# EAGLE schematic Main (EAGLE 9.5.2)
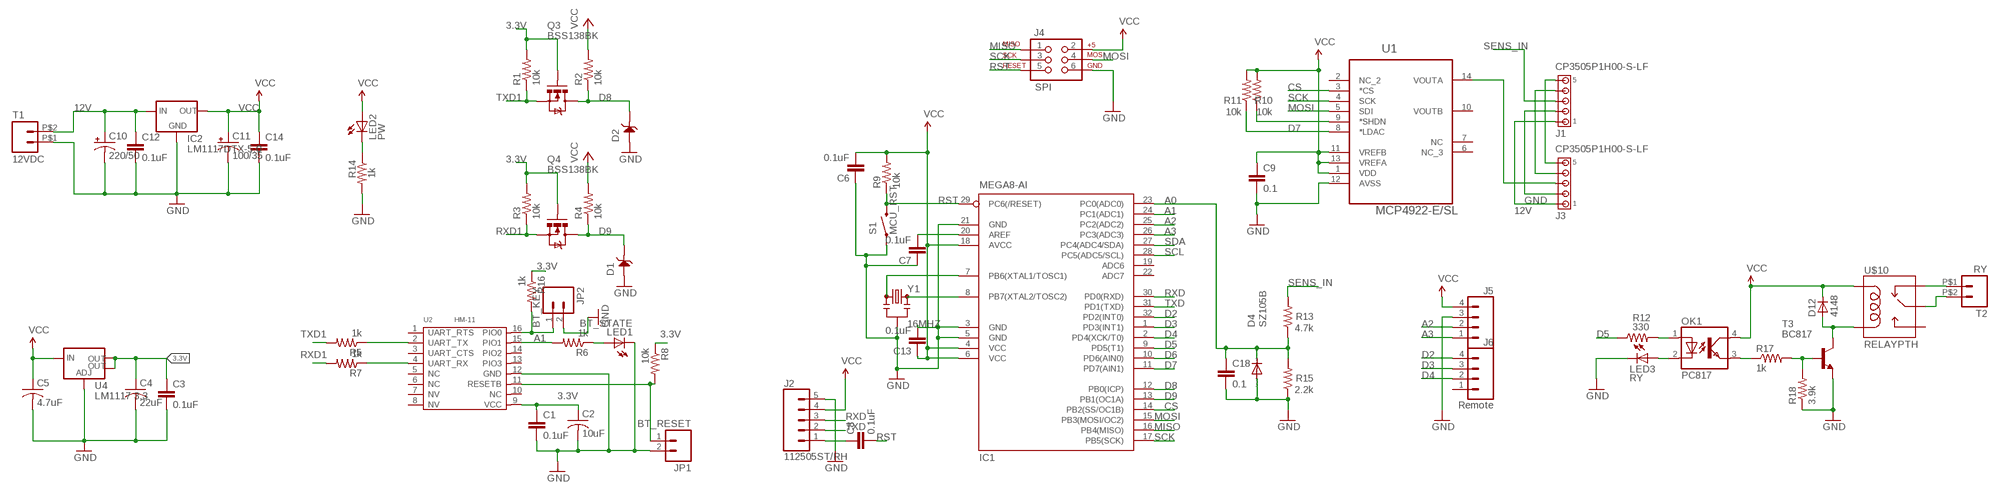
[diagram p0: schematic, sheet 1]

## Parts
C1  0.1uF  CAP0805  [0805]
C2  10uF  C-USC1206  [C1206]
C3  0.1uF  CAP0805  [0805]
C4  22uF  C-USC1206  [C1206]
C5  4.7uF  C-USC1206  [C1206]
C6  0.1uF  CAP0805  [0805]
C7  0.1uF  CAP0805  [0805]
C8  0.1uF  CAP0805  [0805]
C9  0.1  CAP0805  [0805]
C10  220/50  CPOL-US153CLV-1010  [153CLV-1010]
C11  100/35  CPOL-US153CLV-0605  [153CLV-0605]
C12  0.1uF  CAP0805  [0805]
C13  0.1uF  CAP0805  [0805]
C14  0.1uF  CAP0805  [0805]
C18  0.1  CAP0805  [0805]
D1  SMF5.0A  D-ESD-2P'CESD5V0D1'  [SOD123-2.7X1.6]
D2  SMF5.0A  D-ESD-2P'CESD5V0D1'  [SOD123-2.7X1.6]
D4  SZ105B  DIODE-DO-214AC  [DO-214AC]
D12  4148  D-SOD-80  [SOD80]
IC1  MEGA8-AI  [TQFP32-08]
IC2  LM1117DTX-5.0  LM1117DTX-3.3  [TO252]
J1  CP3505P1H00-S-LF  1445055-5  [1445055-5]
J2  112505ST/RH  CONN_05JST  [JST-5-PTH]
J3  CP3505P1H00-S-LF  1445055-5  [1445055-5]
J4  SPI  AVR_SPI_PRG_6PTH  [2X3]
J5  CONN_04JST-PTH  [JST-4-PTH]
J6  Remote  CONN_04JST-PTH  [JST-4-PTH]
JP1  BT_RESET  M02PTH  [1X02]
JP2  BT_KEY  M02PTH  [1X02]
LED1  BT_STATE  LED3MM  [LED3MM]
LED2  PW  LED3MM  [LED3MM]
LED3  RY  LED3MM  [LED3MM]
OK1  PC817  LTV816S  [DIL4-SMD]
Q3  BSS138BK  MOSFET-NCHANNELBSS138  [SOT23-3]
Q4  BSS138BK  MOSFET-NCHANNELBSS138  [SOT23-3]
R1  10k  RESISTOR0805-RES  [0805]
R2  10k  RESISTOR0805-RES  [0805]
R3  10k  RESISTOR0805-RES  [0805]
R4  10k  RESISTOR0805-RES  [0805]
R5  1k  RESISTOR0805-RES  [0805]
R6  1k  RESISTOR0805-RES  [0805]
R7  1k  RESISTOR0805-RES  [0805]
R8  10k  RESISTOR0805-RES  [0805]
R9  10k  RESISTOR0805-RES  [0805]
R10  10k  RESISTOR0805-RES  [0805]
R11  10k  RESISTOR0805-RES  [0805]
R12  330  RESISTOR0805-RES  [0805]
R13  4.7k  RESISTOR0805-RES  [0805]
R14  1k  RESISTOR0805-RES  [0805]
R15  2.2k  RESISTOR0805-RES  [0805]
R16  1k  RESISTOR0805-RES  [0805]
R17  1k  RESISTOR0805-RES  [0805]
R18  3.9k  RESISTOR0805-RES  [0805]
S1  MCU_RST  SWITCH-MOMENTARY-2SMD-1101NE  [TACTILE-SWITCH-1101NE]
T1  12VDC  ST02-3.5MM  [ED350V-02P]
T2  RY  ST02-3.5MM  [ED350V-02P]
T3  BC817  BC817-16-NPN-SOT23-BEC  [SOT23-BEC]
U1  MCP4922-E/SL  [SOIC127P600X175-14N]
U2  HM-11  [16P-18.5X13.5X0.8]
U4  LM1117 3.3  V_REG_LM1117SOT223  [SOT223]
U$10  RELAYPTH  [SRD-05VDC-SL-C]
Y1  16MHZ  RESONATOR16MHZ  [RESONATOR-SMD]

## Nets
3.3V: C1.1 C2.1 C3.1 C4.1 Q3.1(G) Q4.1(G) R1.2 R3.2 R8.1 R16.1 U2.9(VCC) U4.2(OUT) U4.4(OUT)
12V: C10.+ C12.1 IC2.2(IN) J1.1 J3.1 T1.P$2
A0: C18.1 D4.C IC1.23(PC0(ADC0)) R13.1 R15.2
A1: IC1.24(PC1(ADC1)) R6.2 U2.15(PIO1)
A2: IC1.25(PC2(ADC2)) J5.2
A3: IC1.26(PC3(ADC3)) J5.1
CS: IC1.14(PB2(SS/OC1B)) U1.3(*CS)
D2: IC1.32(PD2(INT0)) J6.4
D3: IC1.1(PD3(INT1)) J6.3
D4: IC1.2(PD4(XCK/T0)) J6.2
D5: IC1.9(PD5(T1)) R12.1
D6: IC1.10(PD6(AIN0))
D7: IC1.11(PD7(AIN1)) R11.1 U1.8(*LDAC)
D8: D2.2 IC1.12(PB0(ICP)) Q3.3(D) R2.1
D9: D1.2 IC1.13(PB1(OC1A)) Q4.3(D) R4.1
GND: C1.2 C2.2 C3.2 C4.2 C5.2 C6.1 C7.1 C9.2 C10.- C11.- C12.2 C13.2 C14.2 C18.2 D1.1 D2.1 D4.A IC1.3(GND) IC1.5(GND) IC1.21(GND) IC2.1(GND) J1.2 J2.5 J3.2 J4.6 J5.3 JP1.2 JP2.2 LED1.K(C) LED3.K(C) R14.2 R15.1 R18.1 S1.1 T1.P$1 T3.E U1.12(AVSS) U2.12(GND) U4.1(ADJ) Y1.2
MISO: IC1.16(PB4(MISO)) J4.1
MOSI: IC1.15(PB3(MOSI/OC2)) J4.4 U1.5(SDI)
N$1: LED1.A R6.1
N$2: JP2.1 R16.2 U2.16(PIO0)
N$3: R5.1 U2.2(UART_TX)
N$4: JP1.1 R8.2 U2.11(RESETB)
N$5: IC1.8(PB7(XTAL2/TOSC2)) Y1.3
N$6: R7.1 U2.4(UART_RX)
N$7: IC1.7(PB6(XTAL1/TOSC1)) Y1.1
N$8: C7.2 IC1.20(AREF)
N$9: C8.1 J2.1
N$12: LED2.K(C) R14.1
N$13: J3.3 U1.14(VOUTA)
N$14: J1.5 J3.5
N$15: J1.4 J3.4
N$16: R10.1 U1.9(*SHDN)
N$20: OK1.3(EMIT) R17.1
N$21: R17.2 R18.2 T3.B
N$22: D12.2(A) T3.C U$10.COIL0
N$23: OK1.1(A) R12.2
N$24: T2.P$1 U$10.SWCLOSED(SWCLOSE)
N$25: T2.P$2 U$10.SWCOMMON
N$31: LED3.A OK1.2(C)
RST: C8.2 IC1.29(PC6(/RESET)) J4.5 R9.1 S1.2
RXD: IC1.30(PD0(RXD)) J2.3
RXD1: Q4.2(S) R3.1 R7.2
SCK: IC1.17(PB5(SCK)) J4.3 U1.4(SCK)
SCL: IC1.28(PC5(ADC5/SCL))
SDA: IC1.27(PC4(ADC4/SDA))
SENS_IN: J1.3 R13.2
TXD: IC1.31(PD1(TXD)) J2.2
TXD1: Q3.2(S) R1.1 R5.2
VCC: C5.1 C6.2 C9.1 C11.+ C13.1 C14.1 D12.1(C) IC1.4(VCC) IC1.6(VCC) IC1.18(AVCC) IC2.TAB(OUT) J2.4 J4.2 J5.4 LED2.A OK1.4(COL) R2.2 R4.2 R9.2 R10.2 R11.2 U1.1(VDD) U1.11(VREFB) U1.13(VREFA) U4.3(IN) U$10.COIL1
Unconnected: IC1.19(ADC6) IC1.22(ADC7) J6.1 U1.2(NC_2) U1.6(NC_3) U1.7(NC) U1.10(VOUTB) U2.1(UART_RTS) U2.3(UART_CTS) U2.5(NC) U2.6(NC) U2.7(NV) U2.8(NV) U2.10(NC) U2.13(PIO3) U2.14(PIO2) U$10.SWOPEN

## Library data of the parts
C1 = SparkFun-Capacitors:CAP: Capacitor Standard 0603 ceramic capacitor, and 0.1" leaded capacitor.
C2 C4 C5 = adafruit:C-US: CAPACITOR, American symbol
C3 C6-C9 C12-C14 C18 = SparkFun-Passives:CAP: Capacitor Standard 0603 ceramic capacitor, and 0.1" leaded capacitor.
C10 C11 = adafruit:CPOL-US: POLARIZED CAPACITOR, American symbol
D1 D2 = discrete:D-ESD-2P: Diodes for Protectiong against ESD
D4 = diode:DIODE-: DIODE
D12 = semicon-smd-ipc:D-: DIODE unfilled
IC1 = atmel:MEGA8: MICROCONTROLLER 8 Kbytes FLASH, 1 kbytes SRAM, 512 bytes EEPROM, USART, 6-channel 10 bit ADC, 2-channel 8 bit ADC Pin compatible with Atmega48, ATMega88, ATMega168 Source: avr.lbr; MPN: ATMEGA8-16AU; OC_FARNELL: 9171371; OC_NEWARK: 73M8863
IC2 = lm1117:LM1117DTX-*
J1 J3 = con-amp:1445055-5: Micro MATE-N-LOK Connectors grid 1.5 mm Source: ENG_CD_1445055_A.pdf
J2 = SparkFun-Connectors:CONN_05: Multi connection point. Often used as Generic Header-pin footprint for 0.1 inch spaced/style header connections On any of the 0.1 inch spaced packages, you can populate with these: Break Away Headers - Straight <https://www.sparkfun.com/products/116> (PRT-00116) Break Away Male Headers - Right Angle <https://www.sparkfun.com/products/553> (PRT-00553) Female Headers <https://www.sparkfun.com/products/115> (PRT-00115) Break Away Headers - Machine Pin <https://www.sparkfun.com/products/117> (PRT-00117) Break Away Female Headers - Swiss Machine Pin <https://www.sparkfun.com/products/743> (PRT-00743) For SCREWTERMINALS and SPRING TERMINALS visit here: Screw Terimnals on SparkFun.com <https://www.sparkfun.com/search/results?term=Screw+Terminals> (5mm/3.5mm/2.54mm spacing) This device is also useful as a general connection point to wire up your design to another part of your project. Our various solder wires solder well into these plated through hole pads. Hook-Up Wire - Assortment (Stranded, 22 AWG) <https://www.sparkfun.com/products/11375> (PRT-11375) Hook-Up Wire - Assortment (Solid Core, 22 AWG) <https://www.sparkfun.com/products/11367> (PRT-11367) View the entire wire category on our website here <https://www.sparkfun.com/categories/141> Special notes: Molex polarized connector foot print use with SKU : PRT-08231 with associated crimp pins and housings. 1MM SMD Version SKU: PRT-10208; SF_ID: PRT-09917
J4 = SparkFun-Connectors:AVR_SPI_PRG_6: AVR ISP 6 Pin This is the reduced ISP connector for AVR programming. Common on Arduino. This footprint will take up less PCB space and can be used with a 10-pin to 6-pin adapter such as SKU: BOB-08508 **Special note about "TEST_POINT" package. The stop mask is on the top side, so if you want your programming test points to be on the bottom of your board, make sure to place this package on the bottom side of the board. This also ensure that the orientation to program from the bottom side will be correct.
J5 J6 = SparkFun-Connectors:CONN_04: Multi connection point. Often used as Generic Header-pin footprint for 0.1 inch spaced/style header connections On any of the 0.1 inch spaced packages, you can populate with these: Break Away Headers - Straight <https://www.sparkfun.com/products/116> (PRT-00116) Break Away Male Headers - Right Angle <https://www.sparkfun.com/products/553> (PRT-00553) Female Headers <https://www.sparkfun.com/products/115> (PRT-00115) Break Away Headers - Machine Pin <https://www.sparkfun.com/products/117> (PRT-00117) Break Away Female Headers - Swiss Machine Pin <https://www.sparkfun.com/products/743> (PRT-00743) For SCREWTERMINALS and SPRING TERMINALS visit here: Screw Terimnals on SparkFun.com <https://www.sparkfun.com/search/results?term=Screw+Terminals> (5mm/3.5mm/2.54mm spacing) This device is also useful as a general connection point to wire up your design to another part of your project. Our various solder wires solder well into these plated through hole pads. Hook-Up Wire - Assortment (Stranded, 22 AWG) <https://www.sparkfun.com/products/11375> (PRT-11375) Hook-Up Wire - Assortment (Solid Core, 22 AWG) <https://www.sparkfun.com/products/11367> (PRT-11367) View the entire wire category on our website here <https://www.sparkfun.com/categories/141> Special notes: Molex polarized connector foot print use with SKU : PRT-08231 with associated crimp pins and housings. 1MM SMD Version SKU: PRT-10208; PROD_ID: WIRE-13531; SF_ID: PRT-09916
JP1 JP2 = SparkFun:M02: Header 2 Standard 2-pin 0.1" header. Use with straight break away headers (SKU : PRT-00116), right angle break away headers (PRT-00553), swiss pins (PRT-00743), machine pins (PRT-00117), and female headers (PRT-00115). Molex polarized connector foot print use with SKU : PRT-08233 with associated crimp pins and housings.
LED1-LED3 = adafruit:LED: LED OSRAM: - CHIPLED LG R971, LG N971, LY N971, LG Q971, LY Q971, LO R971, LY R971 LH N974, LH R974 LS Q976, LO Q976, LY Q976 LO Q996 - Hyper CHIPLED LW Q18S LB Q993, LB Q99A, LB R99A - SideLED LS A670, LO A670, LY A670, LG A670, LP A670 LB A673, LV A673, LT A673, LW A673 LH A674 LY A675 LS A676, LA A676, LO A676, LY A676, LW A676 LS A679, LY A679, LG A679 - Hyper Micro SIDELED® LS Y876, LA Y876, LO Y876, LY Y876 LT Y87S - SmartLED LW L88C, LW L88S LB L89C, LB L89S, LG L890 LS L89K, LO L89K, LY L89K LS L896, LA L896, LO L896, LY L896 - TOPLED LS T670, LO T670, LY T670, LG T670, LP T670 LSG T670, LSP T670, LSY T670, LOP T670, LYG T670 LG T671, LOG T671, LSG T671 LB T673, LV T673, LT T673, LW T673 LH T674 LS T676, LA T676, LO T676, LY T676, LB T676, LH T676, LSB T676, LW T676 LB T67C, LV T67C, LT T67C, LS T67K, LO T67K, LY T67K, LW E67C LS E67B, LA E67B, LO E67B, LY E67B, LB E67C, LV E67C, LT E67C LW T67C LS T679, LY T679, LG T679 LS T770, LO T770, LY T770, LG T770, LP T770 LB T773, LV T773, LT T773, LW T773 LH T774 LS E675, LA E675, LY E675, LS T675 LS T776, LA T776, LO T776, LY T776, LB T776 LHGB T686 LT T68C, LB T68C - Hyper Mini TOPLED® LB M676 - Mini TOPLED Santana® LG M470 LS M47K, LO M47K, LY M47K Source: http://www.osram.convergy.de/
OK1 = optocoupler:LTV816: OPTO COUPLER Source: LITEON, LTV816.pdf
Q3 Q4 = SparkFun-DiscreteSemi:MOSFET-NCHANNEL: Common NMOSFET Parts MFG P/N Store ID Prod ID FDD8780 TRANS-09984 SI7820DN TRANS-11055 FDS6630A IC-08089 2N7002PW TRANS-11151 FQP30N06L COM-10213 TRANS-10060 BSS123LT1G TRANS-08345 BSS138 TRANS-00830 BS170 2N7000; PROD_ID: TRANS-00830; VALUE: 200mA/50V
R1-R11 R13-R16 = SparkFun-Resistors:RESISTOR: Resistor Basic schematic elements and footprints for 0603, 1206, and PTH resistors.
R12 R17 R18 = SparkFun-Passives:RESISTOR: Resistor Basic schematic elements and footprints for 0603, 1206, and PTH resistors.
S1 = SparkFun-Electromechanical:SWITCH-MOMENTARY-2: Various NO switches- pushbuttons, reed, etc; PROD_ID: SWCH-00815
T1 T2 = con-dinkle:ST02: Dinkle® Screw Terminal Block - 2 Way -5MM: EK500V series. Rated at 20A, 300VAC. Cable size: 2mm² Supplier: Altronics P2034A Source: http://www.dinkle.com/upfiles/proter21253708953.pdf -5.08MM: The back half of a EK500V4R-04P. Rated at 20A, 300VAC. Cable size: 2mm² Supplier: Altronics P2024 (half of) Source: http://www.dinkle.com/upfiles/proter21253708833.pdf -3.5MM: ED350V series. Rated at 10A, 300VAC. Cable size: 1.4mm² Supplier: Altronics P2028 Source: http://www.dinkle.com/upfiles/proter21253714491.pdf
T3 = transistor:*-NPN-: NPN Transistror BF959 corrected 2008.03.06
U1 = Microchip_By_element14_Batch_1:MCP4922-E/SL: IC, 12BIT DAC DUAL, SPI I/F; MPN: MCP4922-E/SL; OC_FARNELL: 1332114; OC_NEWARK: 08J8748; PACKAGE: SOIC14; SUPPLIER: Microchip
U2 = template:HM-11: Bluetooth Specification V4.0 BLE
U4 = SparkFun-PowerIC:V_REG_LM1117: Voltage Regulator LM1117 Standard adjustable voltage regulator but in SMD form. Spark Fun Electronics SKU : COM-00595; PROD_ID: VREG-08170
U$10 = SRD-05VDC-SL-C:RELAY: SPDT relay (COM-00101)
Y1 = SparkFun-FreqCtrl:RESONATOR: Resonator Small SMD resonator. Used, eg, on the Arduino Pro/ Pro Mini boards. 8MHz- XTAL-08895 16MHz- XTAL-08900; PROD_ID: XTAL-08900

## Net classes
1 power: width 0.203 mm